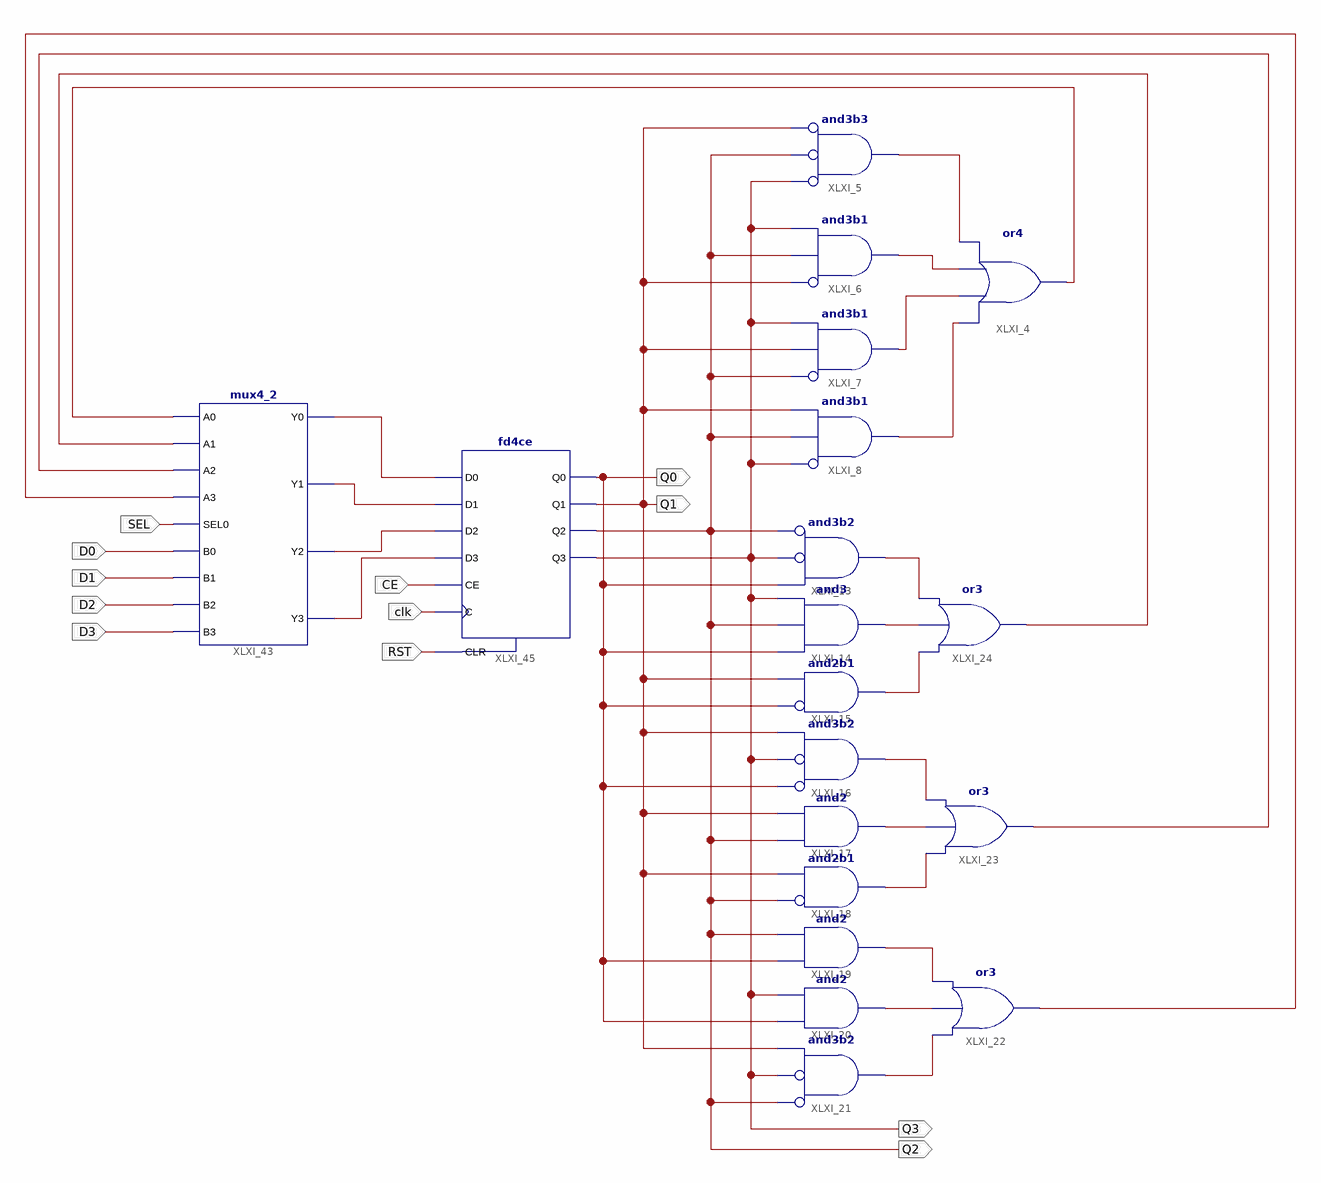
[diagram p0: schematic sheet 1]
// Xilinx ISE schematic counter4.sch (spartan6) as structural Verilog: 19 symbols, 12 ports
module counter4 (
  input  CE,
  input  clk,
  input  RST,
  input  D0,
  input  D1,
  input  SEL,
  input  D2,
  input  D3,
  output Q3,
  output Q1,
  output Q0,
  output Q2
);

  wire XLXN_5, XLXN_7, XLXN_8, XLXN_9, XLXN_10, XLXN_14, XLXN_15, XLXN_16, XLXN_17, XLXN_18, XLXN_19,
       XLXN_20, XLXN_21, XLXN_22, XLXN_23, XLXN_25, XLXN_62, XLXN_64, XLXN_67, XLXN_68, XLXN_69;

  and XLXI_5 (XLXN_5, ~Q3, ~Q2, ~Q1);  // and3b3
  and XLXI_6 (XLXN_7, ~Q1, Q2, Q3);  // and3b1
  and XLXI_7 (XLXN_8, ~Q2, Q1, Q3);  // and3b1
  and XLXI_8 (XLXN_9, ~Q3, Q2, Q1);  // and3b1
  or XLXI_4 (XLXN_10, XLXN_9, XLXN_8, XLXN_7, XLXN_5);
  and XLXI_13 (XLXN_14, ~Q2, ~Q3, Q0);  // and3b2
  and XLXI_14 (XLXN_15, Q0, Q2, Q3);
  and XLXI_15 (XLXN_16, ~Q0, Q1);  // and2b1
  and XLXI_16 (XLXN_17, ~Q0, ~Q3, Q1);  // and3b2
  and XLXI_17 (XLXN_18, Q2, Q1);
  and XLXI_18 (XLXN_19, ~Q2, Q1);  // and2b1
  and XLXI_19 (XLXN_20, Q0, Q2);
  and XLXI_20 (XLXN_21, Q0, Q3);
  and XLXI_21 (XLXN_22, ~Q2, ~Q3, Q1);  // and3b2
  or XLXI_23 (XLXN_62, XLXN_19, XLXN_18, XLXN_17);
  or XLXI_24 (XLXN_23, XLXN_16, XLXN_15, XLXN_14);
  or XLXI_22 (XLXN_25, XLXN_22, XLXN_21, XLXN_20);
  mux4_2 XLXI_43 (
    .A0(XLXN_10), .SEL0(SEL), .B3(D3), .Y0(XLXN_64), .Y1(XLXN_67), .Y2(XLXN_68), .Y3(XLXN_69), .A1(XLXN_23),
    .A2(XLXN_62), .B0(D0), .A3(XLXN_25), .B2(D2), .B1(D1));
  fd4ce XLXI_45 (
    .C(clk), .CE(CE), .CLR(RST), .D0(XLXN_64), .D1(XLXN_67), .D2(XLXN_68), .D3(XLXN_69), .Q0(Q0), .Q1(Q1),
    .Q2(Q2), .Q3(Q3));
endmodule
